# Altium project PCB_Project.PrjPcb
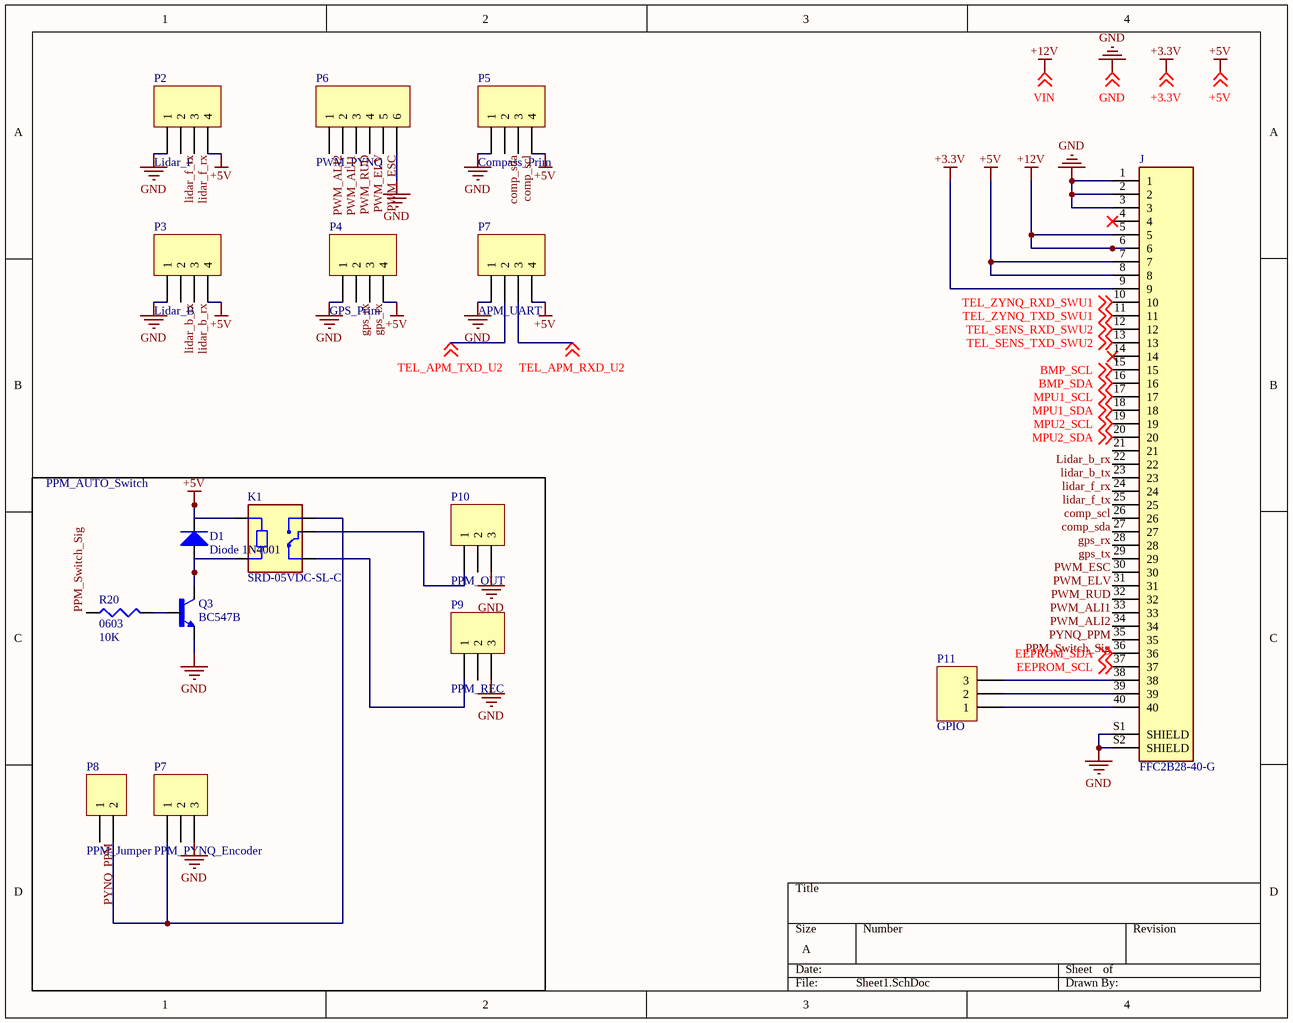
[diagram p0: Sheet1.SchDoc]
4 sheets, 63 parts. Net scope: global (net labels, ports and power ports of the same name join across sheets).
Board file: PCB1.PcbDoc
Sheets:
  Sheet1.SchDoc
  ESP32.SchDoc
  Sensors.SchDoc
  Voltage_Regulators.SchDoc

## Sheet Sheet1.SchDoc
size A

### Parts
(Parts that share a designator on the sheet are numbered #1, #2 ... from top to bottom, then left to right.)
D1  Diode 1N4001  [DO-41]
J  FFC2B28-40-G  [GCT_FFC2B28-40-G]
K1  SRD-05VDC-SL-C  [RELAY_SRD-05VDC-SL-C]
P2  Lidar_F  [HDR1X4]
P3  Lidar_B  [HDR1X4]
P4  GPS_Prim  [HDR1X4]
P5  Compass_Prim  [HDR1X4]
P6  PWM_PYNQ  [HDR1X6]
P7#1  APM_UART  [HDR1X4]
P7#2  PPM_PYNQ_Encoder  [HDR1X3]
P8  PPM_Jumper  [HDR1X2]
P9  PPM_REC  [HDR1X3]
P10  PPM_OUT  [HDR1X3]
P11  GPIO  [HDR1X3]
Q3  BC547B  [TO92250P510H770-3]
R20  0603  value 10K  [J1-0603]

### Blocks framed on the sheet
PPM_AUTO_Switch: D1 K1 P7#2 P8-P10 Q3 R20

### Nets
+3.3V: J.9 ; off-sheet +3.3V
+5V: D1.2(K) J.7 J.8 K1.A1 P2.4 P3.4 P4.4 P5.4 P7#1.4 ; off-sheet +5V
+12V: J.5 J.6 ; off-sheet VIN  [also labelled VIN]
GND: J.1 J.2 J.3 J.S1(SHIELD) J.S2(SHIELD) P2.1 P3.1 P4.1 P5.1 P6.6 P7#1.1 P7#2.3 P9.3 P10.3 Q3.3(E) ; off-sheet GND
BMP_SCL: J.15 ; off-sheet BMP_SCL
BMP_SDA: J.16 ; off-sheet BMP_SDA
comp_scl: J.25 P5.3
comp_sda: J.26 P5.2
EEPROM_SCL: J.37 ; off-sheet EEPROM_SCL
EEPROM_SDA: J.36 ; off-sheet EEPROM_SDA
gps_rx: J.27 P4.2
gps_tx: J.28 P4.3
lidar_b_rx: J.21 P3.3
lidar_b_tx: J.22 P3.2
lidar_f_rx: J.23 P2.3
lidar_f_tx: J.24 P2.2
MPU1_SCL: J.17 ; off-sheet MPU1_SCL
MPU1_SDA: J.18 ; off-sheet MPU1_SDA
MPU2_SCL: J.19 ; off-sheet MPU2_SCL
MPU2_SDA: J.20 ; off-sheet MPU2_SDA
PPM_Switch_Sig: J.35 R20.1
PWM_ALI1: J.32 P6.2
PWM_ALI2: J.33 P6.1
PWM_ELV: J.30 P6.4
PWM_ESC: J.29 P6.5
PWM_RUD: J.31 P6.3
PYNQ_PPM: J.34 P8.1
TEL_APM_RXD_U2: P7#1.3 ; off-sheet TEL_APM_RXD_U2
TEL_APM_TXD_U2: P7#1.2 ; off-sheet TEL_APM_TXD_U2
TEL_SENS_RXD_SWU2: J.12 ; off-sheet TEL_SENS_RXD_SWU2
TEL_SENS_TXD_SWU2: J.13 ; off-sheet TEL_SENS_TXD_SWU2
TEL_ZYNQ_RXD_SWU1: J.10 ; off-sheet TEL_ZYNQ_RXD_SWU1
TEL_ZYNQ_TXD_SWU1: J.11 ; off-sheet TEL_ZYNQ_TXD_SWU1
NetD1_1: D1.1(A) K1.A2 Q3.1(C)
NetJ_38: J.38 P11.3
NetJ_39: J.39 P11.2
NetJ_40: J.40 P11.1
NetK1_COM: K1.COM P10.1
NetK1_NC: K1.NC P9.1
NetK1_NO: K1.NO P7#2.1 P8.2
NetQ3_2: Q3.2(B) R20.2

Not connected (* = marked no-connect by the designer): J 4* 14*; P7#2 2; P9 2; P10 2

### Library data of the parts
D1 = Diode 1N4001: 1 Amp General Purpose Rectifier; Published: 8-Jun-2000; LatestRevisionDate: 17-Jul-2002; LatestRevisionNote: Re-released for DXP Platform.; DatasheetVersion: 1998; PackageVersion: Aug-1999; PackageReference: DO-41; Publisher: Altium Limited; PackageDescription: Diode, Axial; Body 5.2 x 2.7 mm (LxDia. max), Lead Dia. 0.86 mm (max); Code_JEDEC: DO-204-AL; ComponentLink1Description: Manufacturer Link; ComponentLink1URL: http://www.fairchildsemi.com/; ComponentLink2Description: Datasheet; ComponentLink2URL: http://www.fairchildsemi.com/ds/1N%2F1N4001.pdf
J = FFC2B28-40-G: 40 Position FFC, FPC Connector Contacts, Top and Bottom 0.020 _0.50mm_ Surface Mount, Right Angle; MF: Global Connector Technology; Value: *; MP: FFC2B28-40-G; Package: Package Analog Devices; Price: None; Availability: Unavailable; SnapEDA_Link: https://www.snapeda.com/parts/FFC2B28-40-G/Global%20Connector%20Technology/view-part/4223068/?ref=snap
K1 = SRD-05VDC-SL-C: 5V Trigger Relay Module For Arduino And Raspberry Pi 5V Trigger Relay Module For Arduino And Raspberry Pi; Package: None; Availability: Unavailable; Value: *; MP: SRD-05VDC-SL-C; Price: None
P2-P5 P7#1 = Header 4: Header, 4-Pin; LatestRevisionDate: 17-Jul-2002; LatestRevisionNote: Re-released for DXP Platform.; Publisher: Altium Limited
P6 = Header 6: Header, 6-Pin; LatestRevisionDate: 17-Jul-2002; LatestRevisionNote: Re-released for DXP Platform.; Publisher: Altium Limited
P7#2 P9-P11 = Header 3: Header, 3-Pin; LatestRevisionDate: 17-Jul-2002; LatestRevisionNote: Re-released for DXP Platform.; Publisher: Altium Limited
P8 = Header 2: Header, 2-Pin; LatestRevisionDate: 17-Jul-2002; LatestRevisionNote: Re-released for DXP Platform.; Publisher: Altium Limited
Q3 = BC547B: <a href="https://pricing.snapeda.com/parts/BC337-16%20A1/Taiwan%20Semiconductor/view-part?ref=eda">Check availability</a> <a href="https://pricing.snapeda.com/parts/BC337-16%20A1/Taiwan%20Semiconductor/view-part?ref=eda">Check availability</a>; Price: None; Value: *; Package: None; Availability: Unavailable; MP: BC547B
R20 = Res3: Resistor; Published: 8-Jun-2000; LatestRevisionDate: 29-May-2009; LatestRevisionNote: IPC-7351 Footprint Added.; PackageReference: J1-0603; Publisher: Altium Limited; PackageDescription: Chip Resistor

## Sheet ESP32.SchDoc
size A
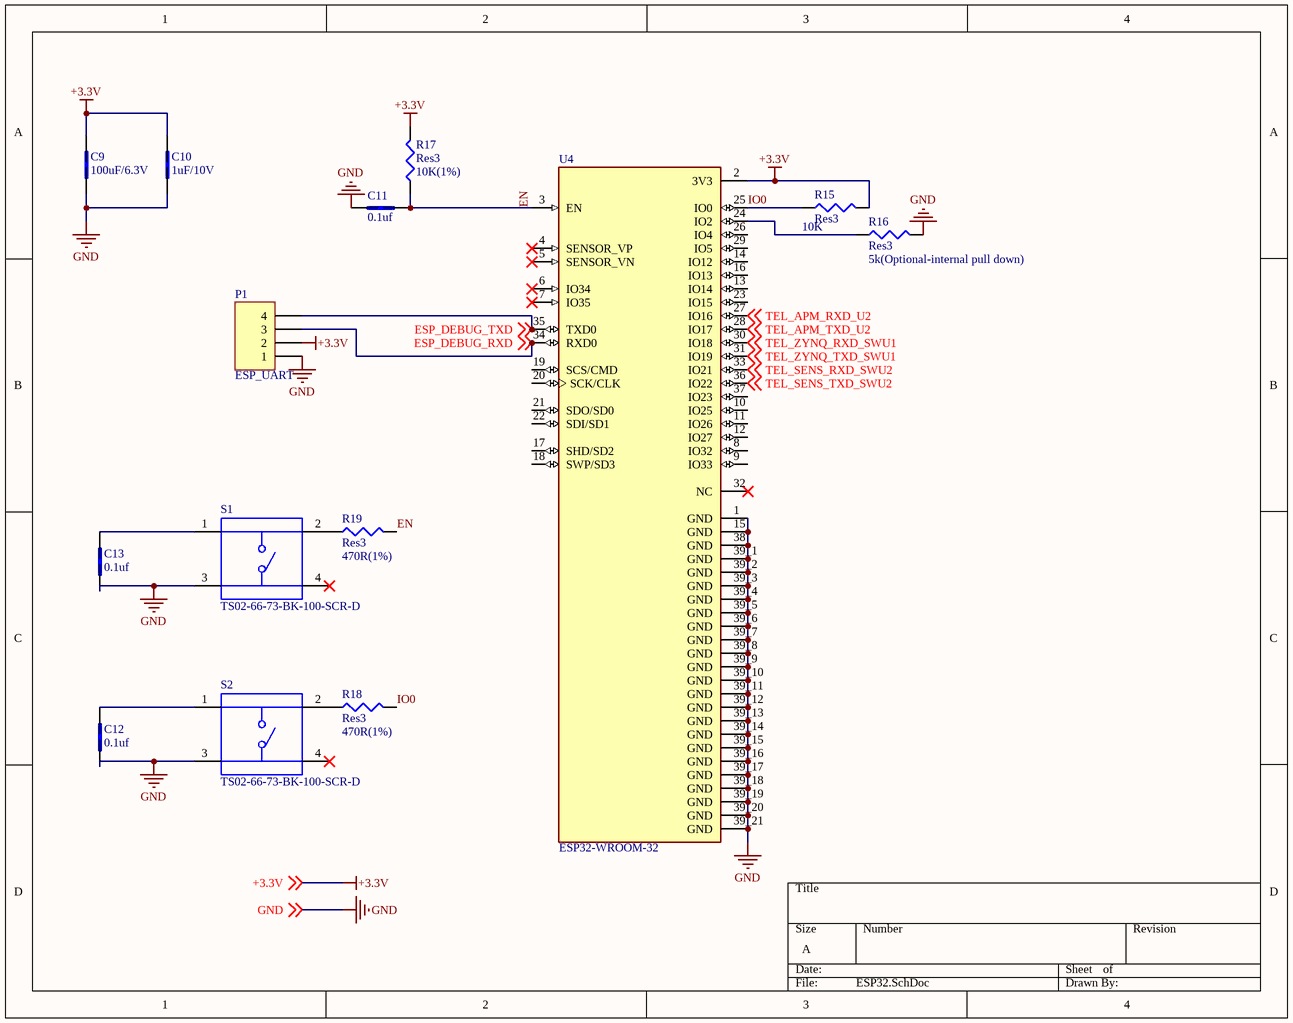
[diagram p1: ESP32.SchDoc]

### Parts
C9  100uF/6.3V  [CAPC1608X90]
C10  1uF/10V  [CAPC1608X90]
C11  0.1uf  [CAPC1608X90]
C12  0.1uf  [CAPC1608X90]
C13  0.1uf  [CAPC1608X90]
P1  ESP_UART  [HDR1X4]
R15  Res3  value 10K  [J1-0603]
R16  Res3  value 5k(Optional-internal pull down)  [J1-0603]
R17  Res3  value 10K(1%)  [J1-0603]
R18  Res3  value 470R(1%)  [J1-0603]
R19  Res3  value 470R(1%)  [J1-0603]
S1  TS02-66-73-BK-100-SCR-D  [SW_TS02-66-73-BK-100-SCR-D]
S2  TS02-66-73-BK-100-SCR-D  [SW_TS02-66-73-BK-100-SCR-D]
U4  ESP32-WROOM-32  [MODULE_ESP32-WROOM-32]

### Nets
+3.3V: C9.2 C10.2 P1.2 R15.2 R17.2 U4.2(3V3) ; off-sheet +3.3V
GND: C9.1 C10.1 C11.2 C12.2 C13.2 P1.1 R16.2 S1.3 S2.3 U4.1(GND) U4.15(GND) U4.38(GND) U4.39_1(GND) U4.39_2(GND) U4.39_3(GND) U4.39_4(GND) U4.39_5(GND) U4.39_6(GND) U4.39_7(GND) U4.39_8(GND) U4.39_9(GND) U4.39_10(GND) U4.39_11(GND) U4.39_12(GND) U4.39_13(GND) U4.39_14(GND) U4.39_15(GND) U4.39_16(GND) U4.39_17(GND) U4.39_18(GND) U4.39_19(GND) U4.39_20(GND) U4.39_21(GND) ; off-sheet GND
EN: C11.1 R17.1 R19.2 U4.3(EN)
ESP_DEBUG_RXD: P1.3 U4.34(RXD0) ; off-sheet ESP_DEBUG_RXD
ESP_DEBUG_TXD: P1.4 U4.35(TXD0) ; off-sheet ESP_DEBUG_TXD
IO0: R15.1 R18.2 U4.25(IO0)
TEL_APM_RXD_U2: U4.27(IO16) ; off-sheet TEL_APM_RXD_U2
TEL_APM_TXD_U2: U4.28(IO17) ; off-sheet TEL_APM_TXD_U2
TEL_SENS_RXD_SWU2: U4.33(IO21) ; off-sheet TEL_SENS_RXD_SWU2
TEL_SENS_TXD_SWU2: U4.36(IO22) ; off-sheet TEL_SENS_TXD_SWU2
TEL_ZYNQ_RXD_SWU1: U4.30(IO18) ; off-sheet TEL_ZYNQ_RXD_SWU1
TEL_ZYNQ_TXD_SWU1: U4.31(IO19) ; off-sheet TEL_ZYNQ_TXD_SWU1
NetC12_1: C12.1 S2.1
NetC13_1: C13.1 S1.1
NetR16_1: R16.1 U4.24(IO2)
NetR18_1: R18.1 S2.2
NetR19_1: R19.1 S1.2

Not connected (* = marked no-connect by the designer): S1 4*; S2 4*; U4 4(SENSOR_VP)* 5(SENSOR_VN)* 6(IO34)* 7(IO35)* 8(IO32) 9(IO33) 10(IO25) 11(IO26) 12(IO27) 13(IO14) 14(IO12) 16(IO13) 17(SHD/SD2) 18(SWP/SD3) 19(SCS/CMD) 20(SCK/CLK) 21(SDO/SD0) 22(SDI/SD1) 23(IO15) 26(IO4) 29(IO5) 32(NC)* 37(IO23)

### Library data of the parts
C9-C13 = C0603C104K5RACTU: 0.1ÂµF Â±10% 50V Ceramic Capacitor X7R 0603 (1608 Metric); MF: KEMET; SnapEDA_Link: https://www.snapeda.com/parts/C0603C104K5RACTU/KEMET/view-part/52584/?ref=snap; MP: C0603C104K5RACTU; Check_prices: https://www.snapeda.com/parts/C0603C104K5RACTU/KEMET/view-part/52584/?ref=eda; Digi-Key_Part_Number: 399-5089-1-ND; Value: *; Package: 0603 Kemet; Purchase-URL: https://pricing.snapeda.com/search/part/C0603C104K5RACTU/?ref=eda
P1 = Header 4: Header, 4-Pin; LatestRevisionDate: 17-Jul-2002; LatestRevisionNote: Re-released for DXP Platform.; Publisher: Altium Limited
R15-R19 = Res3: Resistor; Published: 8-Jun-2000; LatestRevisionDate: 29-May-2009; LatestRevisionNote: IPC-7351 Footprint Added.; PackageReference: J1-0603; Publisher: Altium Limited; PackageDescription: Chip Resistor
S1 S2 = TS02-66-73-BK-100-SCR-D: MF: {'manufacturer': u'CUI'}; Value: *; Package: None; Availability: Unavailable; MP: TS02-66-73-BK-100-SCR-D; Price: None
U4 = ESP32-WROOM-32: Package: None; MP: ESP32-WROOM-32; Value: *; Price: None; Availability: Unavailable

## Sheet Sensors.SchDoc
size A
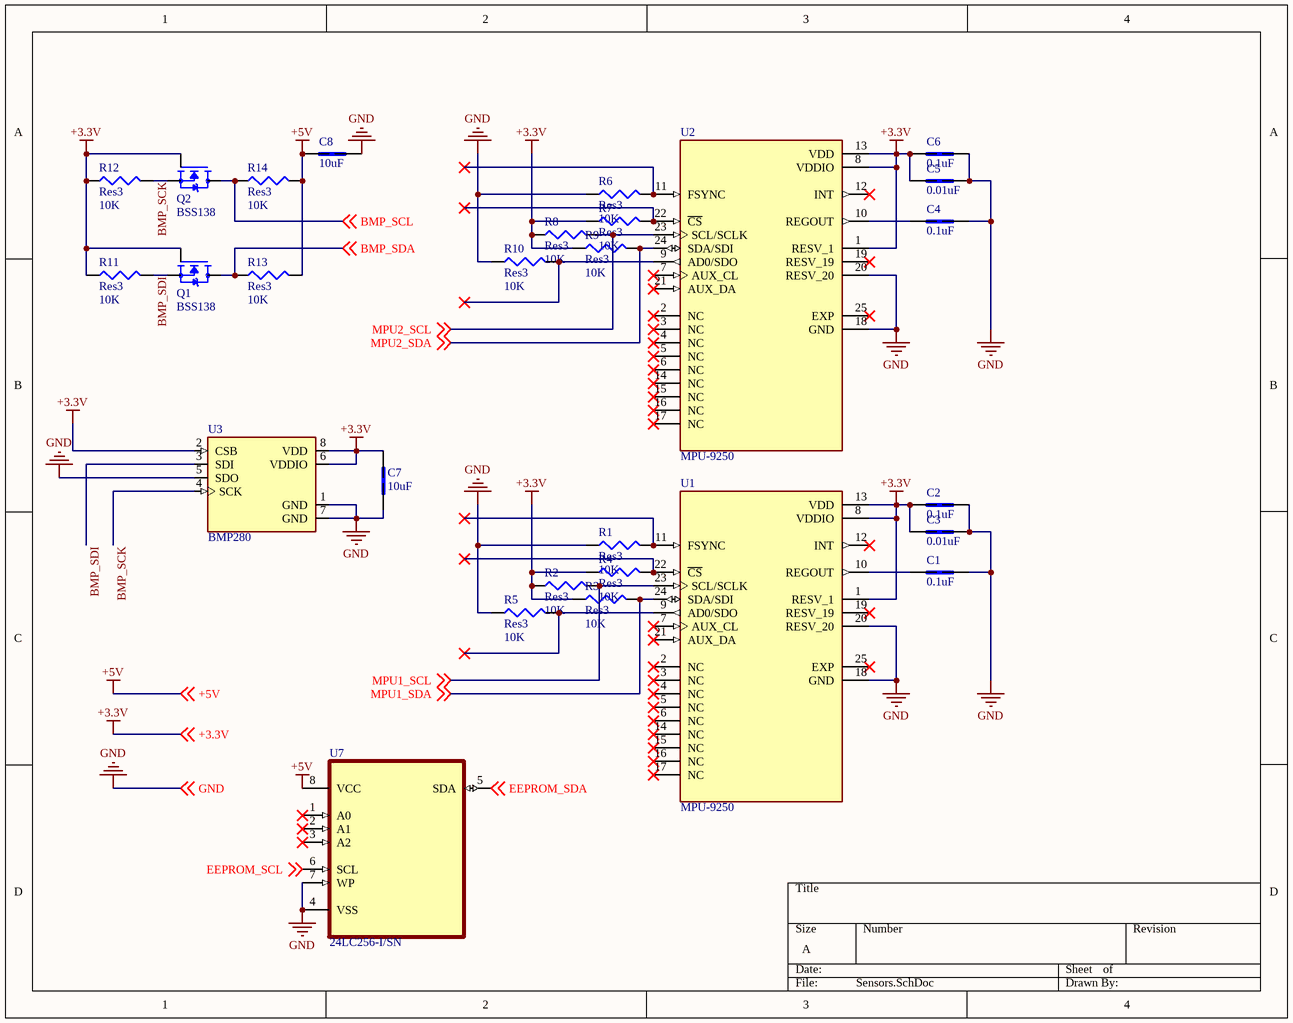
[diagram p2: Sensors.SchDoc]

### Parts
(Parts that share a designator on the sheet are numbered #1, #2 ... from top to bottom, then left to right.)
C1  0.1uF  [CAPC1608X90]
C2  0.1uF  [CAPC1608X90]
C3  0.01uF  [CAPC1608X90]
C4  0.1uF  [CAPC1608X90]
C5  0.01uF  [CAPC1608X90]
C6  0.1uF  [CAPC1608X90]
C7  10uF  [CAPC1608X90]
C8  10uF  [CAPC1608X90]
Q1  BSS138  [SOT95P240X111-3N]
Q2  BSS138  [SOT95P240X111-3N]
R1  Res3  value 10K  [J1-0603]
R2  Res3  value 10K  [J1-0603]
R3  Res3  value 10K  [J1-0603]
R4  Res3  value 10K  [J1-0603]
R5  Res3  value 10K  [J1-0603]
R6  Res3  value 10K  [J1-0603]
R7  Res3  value 10K  [J1-0603]
R8  Res3  value 10K  [J1-0603]
R9  Res3  value 10K  [J1-0603]
R10  Res3  value 10K  [J1-0603]
R11  Res3  value 10K  [J1-0603]
R12  Res3  value 10K  [J1-0603]
R13  Res3  value 10K  [J1-0603]
R14  Res3  value 10K  [J1-0603]
U1  MPU-9250  [QFN40P300X300X105-25N]
U2  MPU-9250  [QFN40P300X300X105-25N]
U3#1  BMP280  [XDCR_BMP280]
U7  24LC256-I/SN  [SOIC127P600X175-8N]

### Nets
+3.3V: C2.1 C3.1 C5.1 C6.1 C7.1 Q1.1(G) Q2.1(G) R2.1 R3.1 R4.1 R7.1 R8.1 R9.1 R11.1 R12.1 U1.1(RESV_1) U1.8(VDDIO) U1.13(VDD) U2.1(RESV_1) U2.8(VDDIO) U2.13(VDD) U3#1.2(CSB) U3#1.6(VDDIO) U3#1.8(VDD) ; off-sheet +3.3V
+5V: C8.1 R13.2 R14.2 U7.8(VCC) ; off-sheet +5V
GND: C1.2 C2.2 C3.2 C4.2 C5.2 C6.2 C7.2 C8.2 R1.1 R5.1 R6.1 R10.1 U1.18(GND) U1.20(RESV_20) U2.18(GND) U2.20(RESV_20) U3#1.1(GND) U3#1.5(SDO) U3#1.7(GND) U7.4(VSS) U7.7(WP) ; off-sheet GND
BMP_SCK: Q2.2(S) R12.2 U3#1.4(SCK)
BMP_SCL: Q2.3(D) R14.1 ; off-sheet BMP_SCL
BMP_SDA: Q1.3(D) R13.1 ; off-sheet BMP_SDA
BMP_SDI: Q1.2(S) R11.2 U3#1.3(SDI)
EEPROM_SCL: U7.6(SCL) ; off-sheet EEPROM_SCL
EEPROM_SDA: U7.5(SDA) ; off-sheet EEPROM_SDA
MPU1_SCL: R2.2 U1.23(SCL/SCLK) ; off-sheet MPU1_SCL
MPU1_SDA: R3.2 U1.24(SDA/SDI) ; off-sheet MPU1_SDA
MPU2_SCL: R8.2 U2.23(SCL/SCLK) ; off-sheet MPU2_SCL
MPU2_SDA: R9.2 U2.24(SDA/SDI) ; off-sheet MPU2_SDA
NetC1_1: C1.1 U1.10(REGOUT)
NetC4_1: C4.1 U2.10(REGOUT)
NetR1_2: R1.2 U1.11(FSYNC)
NetR4_2: R4.2 U1.22(~{CS})
NetR5_2: R5.2 U1.9(AD0/SDO)
NetR6_2: R6.2 U2.11(FSYNC)
NetR7_2: R7.2 U2.22(~{CS})
NetR10_2: R10.2 U2.9(AD0/SDO)

Not connected (* = marked no-connect by the designer): U1 2(NC)* 3(NC)* 4(NC)* 5(NC)* 6(NC)* 7(AUX_CL)* 12(INT)* 14(NC)* 15(NC)* 16(NC)* 17(NC)* 19(RESV_19)* 21(AUX_DA)* 25(EXP)*; U2 2(NC)* 3(NC)* 4(NC)* 5(NC)* 6(NC)* 7(AUX_CL)* 12(INT)* 14(NC)* 15(NC)* 16(NC)* 17(NC)* 19(RESV_19)* 21(AUX_DA)* 25(EXP)*; U7 1(A0)* 2(A1)* 3(A2)*

### Library data of the parts
C1-C8 = C0603C104K5RACTU: as C9 on sheet ESP32; SnapEDA_Link: https://www.snapeda.com/parts/C0603C104K5RACTU/KEMET/view-part/52584/?ref=snap; MP: C0603C104K5RACTU; Check_prices: https://www.snapeda.com/parts/C0603C104K5RACTU/KEMET/view-part/52584/?ref=eda; Digi-Key_Part_Number: 399-5089-1-ND; Value: *; Package: 0603 Kemet; Purchase-URL: https://pricing.snapeda.com/search/part/C0603C104K5RACTU/?ref=eda
Q1 Q2 = BSS138: N-Channel 50V 220mA (Ta) 360mW (Ta) Surface Mount SOT-23-3; Price: None; MP: BSS138; Value: *; Availability: Unavailable; Package: None
R1-R14 = Res3: Resistor; Published: 8-Jun-2000; LatestRevisionDate: 29-May-2009; LatestRevisionNote: IPC-7351 Footprint Added.; PackageReference: J1-0603; Publisher: Altium Limited; PackageDescription: Chip Resistor
U1 U2 = MPU-9250: MPU-9250 series Accelerometer, Gyroscope, Humidity, Magnetometer, Pressure, Temperature Sensor Evaluation Board; MF: TDK InvenSense; Package: TFQFN-24 TDK InvenSense; Purchase-URL: https://pricing.snapeda.com/search/part/MPU-9250/?ref=eda; Value: *; Price: None; Check_prices: https://www.snapeda.com/parts/MPU-9250/TDK+InvenSense/view-part/?ref=eda; MP: MPU-9250; SnapEDA_Link: https://www.snapeda.com/parts/MPU-9250/TDK+InvenSense/view-part/?ref=snap; Availability: In Stock
U3#1 = BMP280: BMP280 Absolute Barometric Pressure Sensor for Battery Powered Devices 2 x 2.5mm; Value: *; Availability: Unavailable; Price: None; MP: BMP280; Package: None
U7 = 24LC256-I/SN: EEPROM Memory IC 256Kb _32K x 8_ IÂ²C 400kHz 900ns 8-SOIC; MF: Microchip; Value: *; MP: 24LC256-I/SN; Package: SOIC-8 Microchip; SnapEDA_Link: https://www.snapeda.com/parts/24LC256-I/SN/Microchip/view-part/9771/?ref=snap; Price: None; Availability: Unavailable

## Sheet Voltage_Regulators.SchDoc
size A
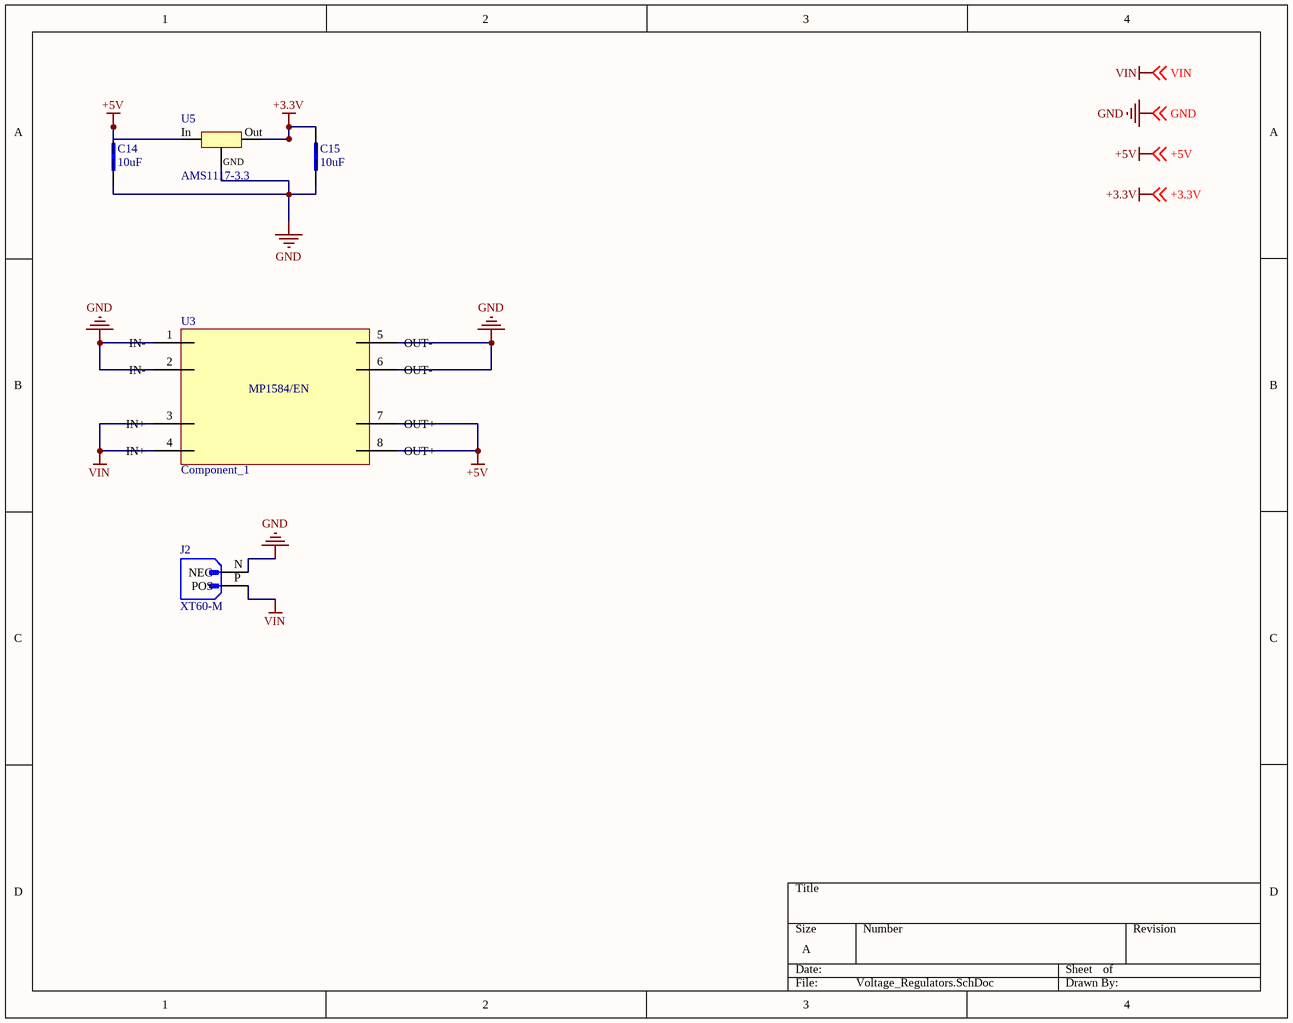
[diagram p3: Voltage_Regulators.SchDoc]

### Parts
(Parts that share a designator on the sheet are numbered #1, #2 ... from top to bottom, then left to right.)
C14  10uF  [CAPC1608X90]
C15  10uF  [CAPC1608X90]
J2  XT60-M  [AMASS_XT60-M]
U3#2  Component_1  [PCBComponent_1]
U5  AMS1117-3.3  [SOT223]

### Nets
+3.3V: C15.1 U5.2 ; off-sheet +3.3V
+5V: C14.1 U3#2.7(OUT+) U3#2.8(OUT+) U5.3 ; off-sheet +5V
GND: C14.2 C15.2 J2.N(NEG) U3#2.1(IN-) U3#2.2(IN-) U3#2.5(OUT-) U3#2.6(OUT-) U5.1 ; off-sheet GND
VIN: J2.P(POS) U3#2.3(IN+) U3#2.4(IN+) ; off-sheet VIN  [project net +12V]

### Notes on the sheet
- (in symbol AMS1117-3.3) In; Out; GND
- (in symbol Component_1) MP1584/EN

### Library data of the parts
C14 C15 = C0603C104K5RACTU: as C9 on sheet ESP32; SnapEDA_Link: https://www.snapeda.com/parts/C0603C104K5RACTU/KEMET/view-part/52584/?ref=snap; MP: C0603C104K5RACTU; Check_prices: https://www.snapeda.com/parts/C0603C104K5RACTU/KEMET/view-part/52584/?ref=eda; Digi-Key_Part_Number: 399-5089-1-ND; Value: *; Package: 0603 Kemet; Purchase-URL: https://pricing.snapeda.com/search/part/C0603C104K5RACTU/?ref=eda
J2 = XT60-M: Plug; DC supply; XT60; male; PIN: 2; for cable; soldered; 30A; 500V; MF: AMASS; Package: Package; Availability: Not in stock; SnapEDA_Link: https://www.snapeda.com/parts/XT60-M/AMASS/view-part/?ref=snap; Check_prices: https://www.snapeda.com/parts/XT60-M/AMASS/view-part/?ref=eda; MP: XT60-M; Price: None; Value: *

## Nets that join several sheets
+3.3V: Sheet1 (J.9), ESP32 (6 pins), Sensors (24 pins), Voltage_Regulators (C15.1 U5.2)
+5V: Sheet1 (9 pins), Sensors (C8.1 R13.2 R14.2 U7.8), Voltage_Regulators (C14.1 U3#2.7 U3#2.8 U5.3)
+12V: Sheet1 (J.5 J.6), Voltage_Regulators (J2.P U3#2.3 U3#2.4)
GND: Sheet1 (15 pins), ESP32 (33 pins), Sensors (21 pins), Voltage_Regulators (8 pins)
BMP_SCL: Sheet1 (J.15), Sensors (Q2.3 R14.1)
BMP_SDA: Sheet1 (J.16), Sensors (Q1.3 R13.1)
EEPROM_SCL: Sheet1 (J.37), Sensors (U7.6)
EEPROM_SDA: Sheet1 (J.36), Sensors (U7.5)
MPU1_SCL: Sheet1 (J.17), Sensors (R2.2 U1.23)
MPU1_SDA: Sheet1 (J.18), Sensors (R3.2 U1.24)
MPU2_SCL: Sheet1 (J.19), Sensors (R8.2 U2.23)
MPU2_SDA: Sheet1 (J.20), Sensors (R9.2 U2.24)
TEL_APM_RXD_U2: Sheet1 (P7#1.3), ESP32 (U4.27)
TEL_APM_TXD_U2: Sheet1 (P7#1.2), ESP32 (U4.28)
TEL_SENS_RXD_SWU2: Sheet1 (J.12), ESP32 (U4.33)
TEL_SENS_TXD_SWU2: Sheet1 (J.13), ESP32 (U4.36)
TEL_ZYNQ_RXD_SWU1: Sheet1 (J.10), ESP32 (U4.30)
TEL_ZYNQ_TXD_SWU1: Sheet1 (J.11), ESP32 (U4.31)